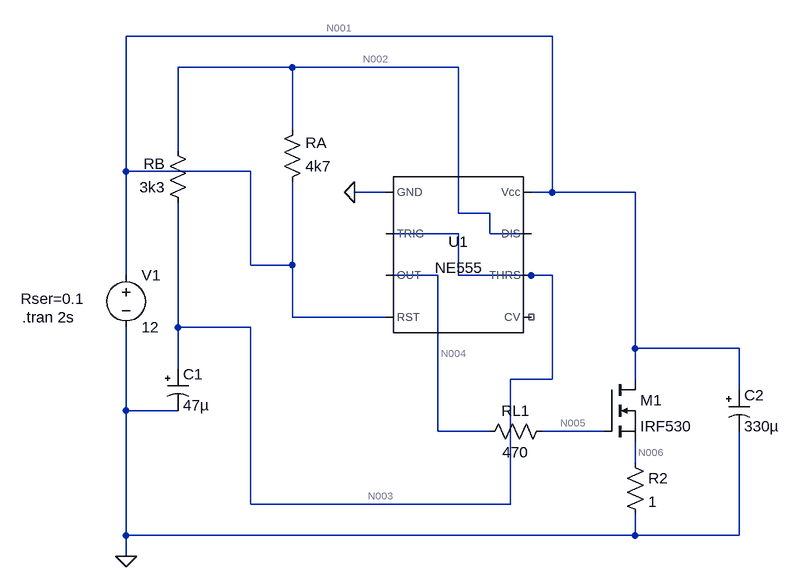
[diagram p0: schematic blinkers.asc]
blinkers.asc, the LTspice schematic file:
Version 4
SHEET 1 1136 820
WIRE 720 -144 64 -144
WIRE 320 -96 144 -96
WIRE 576 -96 320 -96
WIRE 320 0 320 -96
WIRE 144 32 144 -96
WIRE 64 64 64 -144
WIRE 256 64 64 64
WIRE 464 96 416 96
WIRE 720 96 720 -144
WIRE 720 96 688 96
WIRE 848 96 720 96
WIRE 576 128 576 -96
WIRE 624 128 576 128
WIRE 576 160 464 160
WIRE 624 160 624 128
WIRE 688 160 624 160
WIRE 256 208 256 64
WIRE 320 208 320 80
WIRE 320 208 256 208
WIRE 64 224 64 64
WIRE 544 224 464 224
WIRE 576 224 576 160
WIRE 688 224 576 224
WIRE 720 224 688 224
WIRE 320 288 320 208
WIRE 464 288 320 288
WIRE 144 304 144 112
WIRE 256 304 144 304
WIRE 848 336 848 96
WIRE 1008 336 848 336
WIRE 144 368 144 304
WIRE 720 384 720 224
WIRE 720 384 656 384
WIRE 848 384 848 336
WIRE 1008 400 1008 336
WIRE 64 432 64 304
WIRE 144 432 64 432
WIRE 544 464 544 224
WIRE 624 464 544 464
WIRE 800 464 704 464
WIRE 848 512 848 480
WIRE 256 576 256 304
WIRE 656 576 656 384
WIRE 656 576 256 576
WIRE 64 624 64 432
WIRE 848 624 848 592
WIRE 848 624 64 624
WIRE 1008 624 1008 464
WIRE 1008 624 848 624
WIRE 64 656 64 624
FLAG 416 96 0
FLAG 64 656 0
SYMBOL voltage 64 208 R0
WINDOW 123 0 0 Left 0
WINDOW 39 -162 52 Left 2
SYMATTR SpiceLine Rser=0.1
SYMATTR InstName V1
SYMATTR Value 12
SYMBOL Misc\\NE555 576 192 R0
SYMATTR InstName U1
SYMBOL res 160 128 R180
WINDOW 0 36 76 Left 2
WINDOW 3 36 40 Left 2
SYMATTR InstName RB
SYMATTR Value 3k3
SYMBOL res 304 96 M180
WINDOW 0 36 76 Left 2
WINDOW 3 36 40 Left 2
SYMATTR InstName RA
SYMATTR Value 4k7
SYMBOL polcap 128 368 R0
WINDOW 3 24 56 Left 2
SYMATTR Value 47µ
SYMATTR InstName C1
SYMATTR Description Capacitor
SYMATTR Type cap
SYMATTR SpiceLine V=16 Irms=2.59808 Rser=0.04 Lser=0
SYMBOL polcap 992 400 R0
WINDOW 3 24 56 Left 2
SYMATTR Value 330µ
SYMATTR InstName C2
SYMATTR Description Capacitor
SYMATTR Type cap
SYMATTR SpiceLine V=16 Irms=2.59808 Rser=0.04 Lser=0
SYMBOL res 832 496 R0
SYMATTR InstName R2
SYMATTR Value 1
SYMBOL nmos 800 384 R0
SYMATTR InstName M1
SYMATTR Value IRF530
SYMBOL res 608 480 R270
WINDOW 0 32 56 VTop 2
WINDOW 3 0 56 VBottom 2
SYMATTR InstName RL1
SYMATTR Value 470
TEXT -96 288 Left 2 !.tran 2s

The netlist it stands for:
* blinkers.asc
V1 N001 0 12 Rser=0.1
XU1 0 N003 N004 N001 NC_01 N003 N002 N001 NE555  ; pins GND TRIG OUT RST CV THRS DIS Vcc
RB N003 N002 3k3
RA N001 N002 4k7
C1 N003 0 47µ V=16 Irms=2.59808 Rser=0.04 Lser=0
C2 N001 0 330µ V=16 Irms=2.59808 Rser=0.04 Lser=0
R2 N006 0 1
M1 N001 N005 N006 N006 IRF530
RL1 N004 N005 470
.model NMOS NMOS
.model PMOS PMOS
.lib standard.mos
.tran 2s
.lib NE555.sub
.backanno
.end

* Results of the author's LTspice run, read from the files saved beside the schematic
* Operating Point, zero values left out:
*   V(n001) = 11.41 V
*   V(n003) = 11.41 V
*   V(n002) = 11.41 V
*   V(n004) = 11.41 V
*   V(n006) = 5.852 V
*   V(n005) = 11.41 V
*   Id(M1) = 5.852 A
*   Is(M1) = -5.852 A
*   I(R2) = 5.852 A
*   I(Ra) = 38.06 nA
*   I(Rb) = -22.83 nA
*   I(V1) = -5.856 A
*   Ix(u1:1) = -3.691 mA
*   Ix(u1:2) = 11.41 nA
*   Ix(u1:4) = 65.43 µA
*   Ix(u1:6) = 11.41 nA
*   Ix(u1:7) = 15.23 nA
*   Ix(u1:8) = 3.626 mA
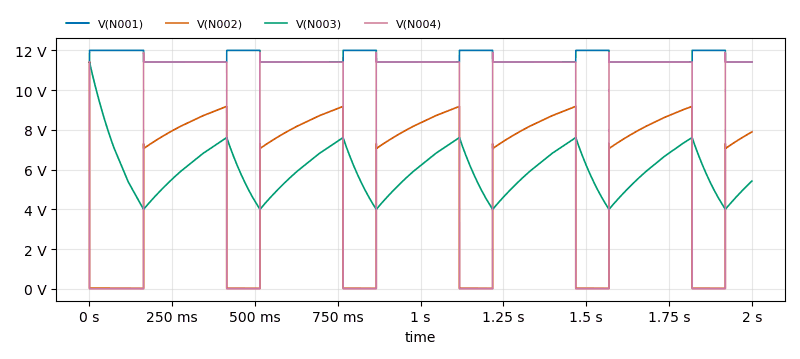
[diagram p1: Transient Analysis of blinkers.asc, plotted from the saved traces]
* Transient Analysis, 1 run:
*   V(N001): min 11.41 V, max 12 V, average 11.61 V, rms 11.61 V, last 11.41 V
*   V(N002): min 22.52 mV, max 11.42 V, average 5.475 V, rms 6.71 V, last 7.895 V
*   V(N003): min 3.999 V, max 11.41 V, average 5.94 V, rms 6.07 V, last 5.423 V
*   V(N004): min 68.5 µV, max 11.9 V, average 7.621 V, rms 9.327 V, last 11.41 V